# Altium schematic sheet Temperature_inputs.SchDoc: Analog temperature
size A4; Engineer: Rain Sarapuu; DocumentNumber: 9; Revision: 1; SheetNumber: 10; SheetTotal: 15
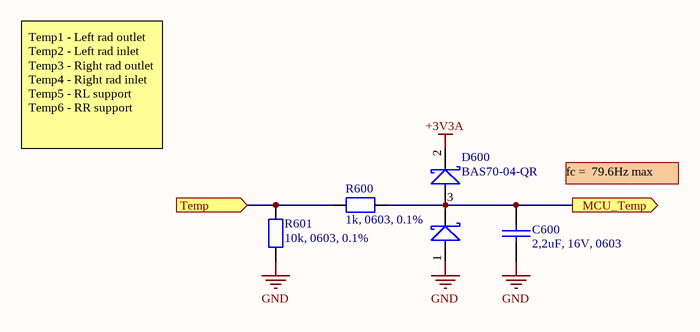
[diagram p0: Temperature_inputs.SchDoc]

## Parts
C600  2,2uF, 16V, 0603  [CAP [0603] 1608]
D600  BAS70-04-QR  [SOT23-3]
R600  1k, 0603, 0.1%  [RES [0603] 1608]
R601  10k, 0603, 0.1%  [RES [0603] 1608]

## Ports
MCU_Temp (out), Temp (in)

## Nets
+3V3A: D600.2
GND: C600.2 D600.1 R601.2
MCU_Temp: C600.1 D600.3 R600.1 ; port MCU_Temp
Temp: R600.2 R601.1 ; port Temp

## Notes on the sheet
- Temp1 - Left rad outlet
  Temp2 - Left rad inlet
  Temp3 - Right rad outlet
  Temp4 - Right rad inlet
  Temp5 - RL support
  Temp6 - RR support
- fc =  79.6Hz max
- Engineer:
- Date:
- Rev:

## Library data of the parts
C600 = CMP-001-00084-16: Default capacitor part; Supplier Part Number: *; Supplier: *; Manufacturer Part Number: *
D600 = CMP-004-00033-4: Diode Small Signal Schottky 70V 70mA 3-Pin SOT-23 T/R; Manufacturer: Nexperia; Supplier Part Number: 771-BAS70-04-QR; Manufacturer Part Number: BAS70-04-QR; Supplier: Mouser; Price: 0,242
R600 R601 = CMP-009-00038-12: Standard resistor part; Supplier Part Number: *; Manufacturer Part Number: *; Supplier: *